# EAGLE design trig3_board_de0-nano - LTC6957 (EAGLE 9.6.2)
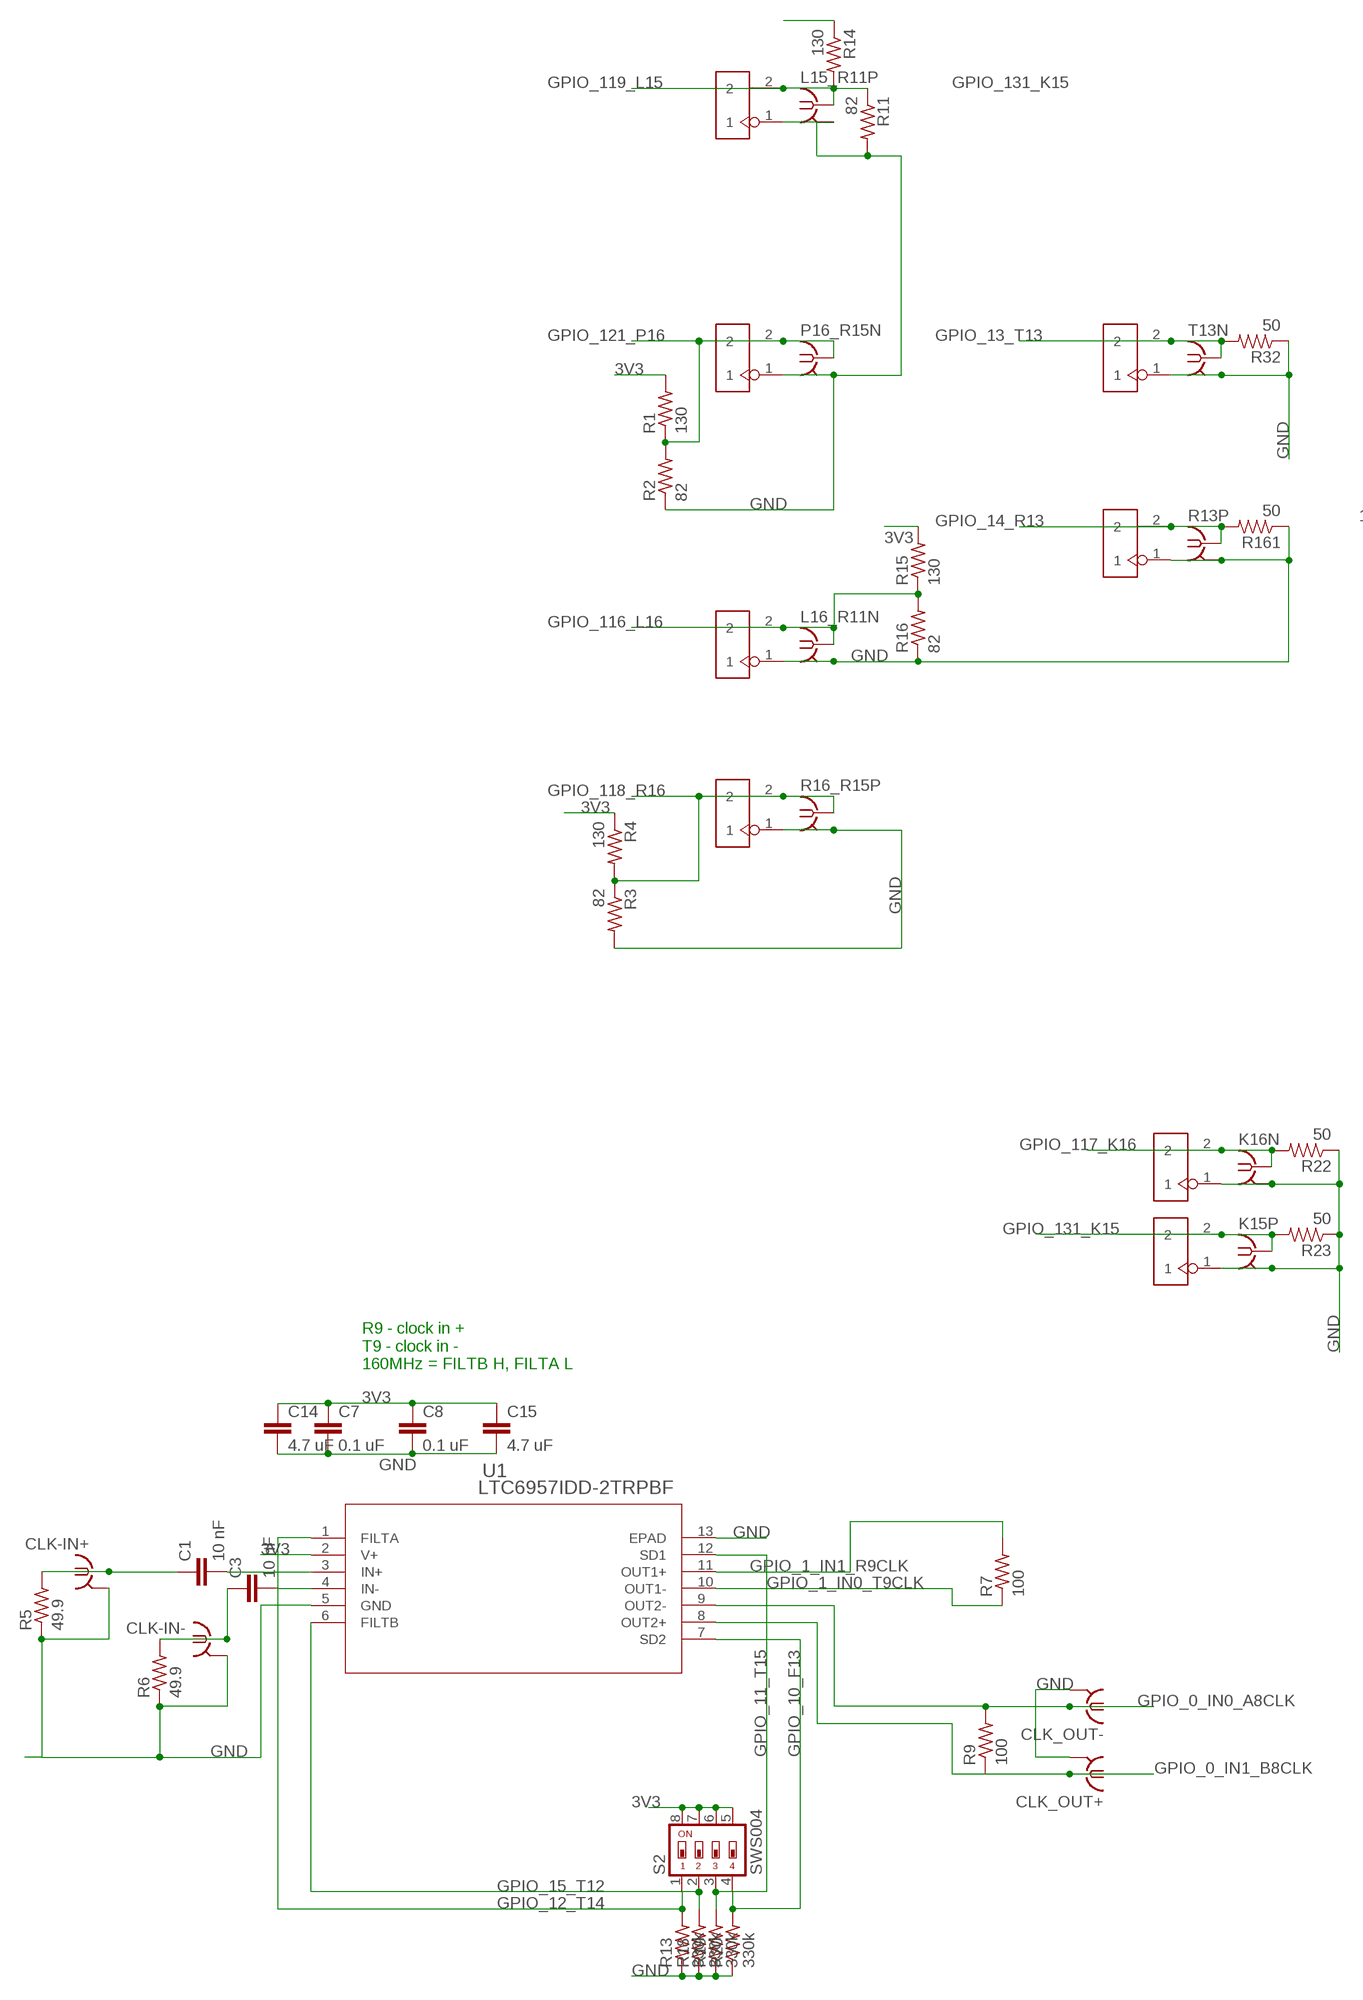
[diagram p0: schematic, sheet 1, part 1 of 2]
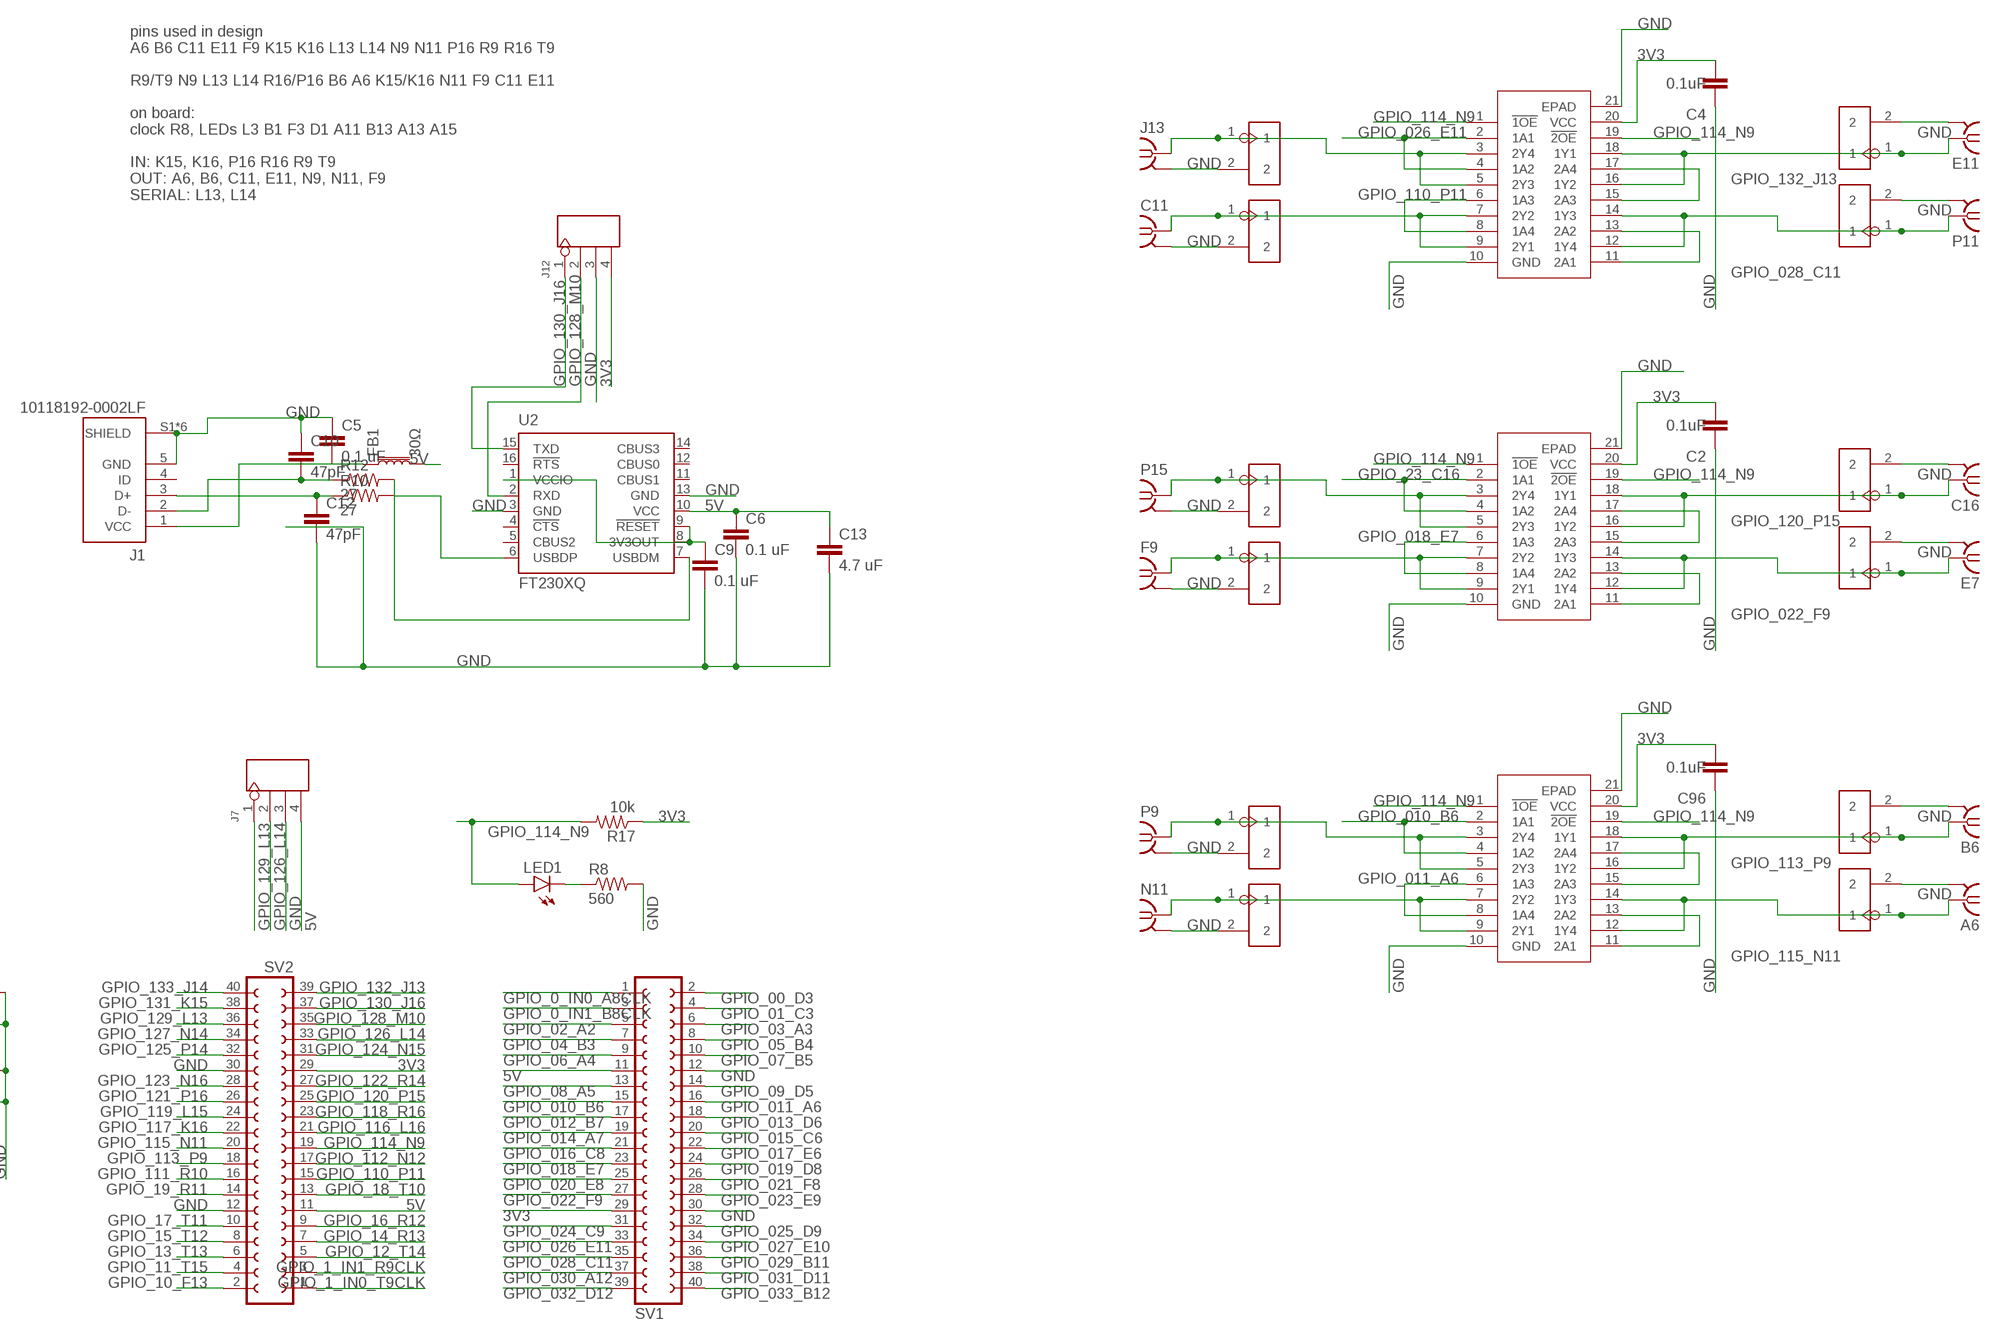
[diagram p1: schematic, sheet 1, part 2 of 2]

## Parts
A6  BU-SMB-V  [BU-SMB-V]
B6  BU-SMB-V  [BU-SMB-V]
C1  10 nF  C-EUC0603  [C0603]
C2  0.1uF  C-EUC0603  [C0603]
C3  10 nF  C-EUC0603  [C0603]
C4  0.1uF  C-EUC0603  [C0603]
C5  0.1 uF  C-EUC0603  [C0603]
C6  0.1 uF  C-EUC0603  [C0603]
C7  0.1 uF  C-EUC0603  [C0603]
C8  0.1 uF  C-EUC0603  [C0603]
C9  0.1 uF  C-EUC0603  [C0603]
C10  47pF  C-EUC0603  [C0603]
C11  BU-SMB-V  [BU-SMB-V]
C12  47pF  C-EUC0603  [C0603]
C13  4.7 uF  C-EUC0603  [C0603]
C14  4.7 uF  C-EUC0603  [C0603]
C15  4.7 uF  C-EUC0603  [C0603]
C16  BU-SMB-V  [BU-SMB-V]
C96  0.1uF  C-EUC0603  [C0603]
CLK-IN+  BU-SMB-V  [BU-SMB-V]
CLK-IN-  BU-SMB-V  [BU-SMB-V]
CLK_OUT+  BU-SMB-V  [BU-SMB-V]
CLK_OUT-  BU-SMB-V  [BU-SMB-V]
E7  BU-SMB-V  [BU-SMB-V]
E11  BU-SMB-V  [BU-SMB-V]
F9  BU-SMB-V  [BU-SMB-V]
FB1  30Ω  FERRITE_BEAD-0603-30OHM-100MHZ  [0603]
J1  10118192-0002LF  [AMPHENOL_10118192-0002LF]
J7  4p-2.54  DIP-BLACK-FEMALE-HEADER-VERT(4P-2.54)  [H4-2.54]
J12  4p-2.54  DIP-BLACK-FEMALE-HEADER-VERT(4P-2.54)  [H4-2.54]
J13  BU-SMB-V  [BU-SMB-V]
J17  2p-2.54  DIP-BLACK-MALE-HEADER-VERT(2P-2.54)  [H2-2.54]
J23  2p-2.54  DIP-BLACK-MALE-HEADER-VERT(2P-2.54)  [H2-2.54]
J24  2p-2.54  DIP-BLACK-MALE-HEADER-VERT(2P-2.54)  [H2-2.54]
J32  2p-2.54  DIP-BLACK-MALE-HEADER-VERT(2P-2.54)  [H2-2.54]
J34  2p-2.54  DIP-BLACK-MALE-HEADER-VERT(2P-2.54)  [H2-2.54]
J38  2p-2.54  DIP-BLACK-MALE-HEADER-VERT(2P-2.54)  [H2-2.54]
J42  2p-2.54  DIP-BLACK-MALE-HEADER-VERT(2P-2.54)  [H2-2.54]
J43  2p-2.54  DIP-BLACK-MALE-HEADER-VERT(2P-2.54)  [H2-2.54]
K15P  BU-SMB-V  [BU-SMB-V]
K16N  BU-SMB-V  [BU-SMB-V]
L15_R11P  BU-SMB-V  [BU-SMB-V]
L16_R11N  BU-SMB-V  [BU-SMB-V]
LED1  red  LEDSML0805  [SML0805]
N11  BU-SMB-V  [BU-SMB-V]
OJ41  2p-2.54  DIP-BLACK-MALE-HEADER-VERT(2P-2.54)  [H2-2.54]
OJ42  2p-2.54  DIP-BLACK-MALE-HEADER-VERT(2P-2.54)  [H2-2.54]
OJ43  2p-2.54  DIP-BLACK-MALE-HEADER-VERT(2P-2.54)  [H2-2.54]
OJ44  2p-2.54  DIP-BLACK-MALE-HEADER-VERT(2P-2.54)  [H2-2.54]
OJ57  2p-2.54  DIP-BLACK-MALE-HEADER-VERT(2P-2.54)  [H2-2.54]
OJ58  2p-2.54  DIP-BLACK-MALE-HEADER-VERT(2P-2.54)  [H2-2.54]
OJ59  2p-2.54  DIP-BLACK-MALE-HEADER-VERT(2P-2.54)  [H2-2.54]
OJ60  2p-2.54  DIP-BLACK-MALE-HEADER-VERT(2P-2.54)  [H2-2.54]
OJ73  2p-2.54  DIP-BLACK-MALE-HEADER-VERT(2P-2.54)  [H2-2.54]
OJ74  2p-2.54  DIP-BLACK-MALE-HEADER-VERT(2P-2.54)  [H2-2.54]
OJ75  2p-2.54  DIP-BLACK-MALE-HEADER-VERT(2P-2.54)  [H2-2.54]
OJ76  2p-2.54  DIP-BLACK-MALE-HEADER-VERT(2P-2.54)  [H2-2.54]
P9  BU-SMB-V  [BU-SMB-V]
P11  BU-SMB-V  [BU-SMB-V]
P15  BU-SMB-V  [BU-SMB-V]
P16_R15N  BU-SMB-V  [BU-SMB-V]
R1  130  R-US_R0603  [R0603]
R2  82  R-US_R0603  [R0603]
R3  82  R-US_R0603  [R0603]
R4  130  R-US_R0603  [R0603]
R5  49.9  R-US_R0603  [R0603]
R6  49.9  R-US_R0603  [R0603]
R7  100  R-US_R0603  [R0603]
R8  560  R-US_R0805  [R0805]
R9  100  R-US_R0603  [R0603]
R10  27  R-US_R0603  [R0603]
R11  82  R-US_R0603  [R0603]
R12  27  R-US_R0603  [R0603]
R13  330k  R-US_R0603  [R0603]
R13P  BU-SMB-V  [BU-SMB-V]
R14  130  R-US_R0603  [R0603]
R15  130  R-US_R0603  [R0603]
R16  82  R-US_R0603  [R0603]
R16_R15P  BU-SMB-V  [BU-SMB-V]
R17  10k  RESISTORAXIAL-0.3  [AXIAL-0.3]
R18  330k  R-US_R0603  [R0603]
R19  330k  R-US_R0603  [R0603]
R20  330k  R-US_R0603  [R0603]
R22  50  RESISTORAXIAL-0.3  [AXIAL-0.3]
R23  50  RESISTORAXIAL-0.3  [AXIAL-0.3]
R32  50  RESISTORAXIAL-0.3  [AXIAL-0.3]
R161  50  RESISTORAXIAL-0.3  [AXIAL-0.3]
S2  SWS004  [SMS-004]
SV1  FE20-2  [FE20-2]
SV2  FE20-2  [FE20-2]
T13N  BU-SMB-V  [BU-SMB-V]
U1  LTC6957IDD-2TRPBF  [DFN-12_DD_LIT]
U2  FT230XQ  [QFN16]
U3  SN74LVTH244ARGYR  [RGY20_3P05X2P05]
U4  SN74LVTH244ARGYR  [RGY20_3P05X2P05]
U5  SN74LVTH244ARGYR  [RGY20_3P05X2P05]

## Nets
3V3 [power]: C2.2 C4.2 C7.1 C8.1 C14.1 C15.1 C96.2 J12.4 R1.2 R4.1 R14.1 R15.2 R17.P$1 S2.5 S2.6 S2.7 S2.8 SV1.29 SV2.29 U1.2(V+) U3.20(VCC) U4.20(VCC) U5.20(VCC)
5V [power]: C6.1 C13.1 FB1.2 J7.4 SV1.11 SV2.11 U2.10(VCC)
GND: A6.2 A6.3 A6.4 A6.5 B6.2 B6.3 B6.4 B6.5 C2.1 C4.1 C5.1 C6.2 C7.2 C8.2 C9.2 C10.1 C11.2 C11.3 C11.4 C11.5 C12.2 C13.2 C14.2 C15.2 C16.2 C16.3 C16.4 C16.5 C96.1 CLK-IN+.2 CLK-IN+.3 CLK-IN+.4 CLK-IN+.5 CLK-IN-.2 CLK-IN-.3 CLK-IN-.4 CLK-IN-.5 CLK_OUT+.2 CLK_OUT+.3 CLK_OUT+.4 CLK_OUT+.5 CLK_OUT-.2 CLK_OUT-.3 CLK_OUT-.4 CLK_OUT-.5 E7.2 E7.3 E7.4 E7.5 E11.2 E11.3 E11.4 E11.5 F9.2 F9.3 F9.4 F9.5 J1.5(GND) J1.S1(SHIELD) J1.S2(SHIELD) J1.S3(SHIELD) J1.S4(SHIELD) J1.S5(SHIELD) J1.S6(SHIELD) J7.3 J12.3 J13.2 J13.3 J13.4 J13.5 J17.1 J23.1 J24.1 J32.1 J34.1 J38.1 J42.1 J43.1 K15P.2 K15P.3 K15P.4 K15P.5 K16N.2 K16N.3 K16N.4 K16N.5 L15_R11P.2 L15_R11P.3 L15_R11P.4 L15_R11P.5 L16_R11N.2 L16_R11N.3 L16_R11N.4 L16_R11N.5 N11.2 N11.3 N11.4 N11.5 OJ41.2 OJ42.2 OJ43.2 OJ44.2 OJ57.2 OJ58.2 OJ59.2 OJ60.2 OJ73.2 OJ74.2 OJ75.2 OJ76.2 P9.2 P9.3 P9.4 P9.5 P11.2 P11.3 P11.4 P11.5 P15.2 P15.3 P15.4 P15.5 P16_R15N.2 P16_R15N.3 P16_R15N.4 P16_R15N.5 R2.1 R3.2 R5.1 R6.1 R8.2 R11.2 R13.1 R13P.2 R13P.3 R13P.4 R13P.5 R16.1 R16_R15P.2 R16_R15P.3 R16_R15P.4 R16_R15P.5 R18.1 R19.1 R20.1 R22.P$1 R23.P$1 R32.P$1 R161.P$1 SV1.12 SV1.30 SV2.12 SV2.30 T13N.2 T13N.3 T13N.4 T13N.5 U1.5(GND) U1.13(EPAD) U2.3(GND) U2.13(GND) U3.10(GND) U3.21(EPAD) U4.10(GND) U4.21(EPAD) U5.10(GND) U5.21(EPAD)
GPIO_00_D3: SV1.2
GPIO_0_IN0_A8CLK: CLK_OUT-.1 R9.2 SV1.1 U1.9(OUT2-)
GPIO_0_IN1_B8CLK: CLK_OUT+.1 R9.1 SV1.3 U1.8(OUT2+)
GPIO_01_C3: SV1.4
GPIO_1_IN0_T9CLK: R7.1 SV2.1 U1.10(OUT1-)
GPIO_1_IN1_R9CLK: R7.2 SV2.3 U1.11(OUT1+)
GPIO_02_A2: SV1.5
GPIO_03_A3: SV1.6
GPIO_04_B3: SV1.7
GPIO_05_B4: SV1.8
GPIO_06_A4: SV1.9
GPIO_07_B5: SV1.10
GPIO_08_A5: SV1.13
GPIO_09_D5: SV1.14
GPIO_010_B6: SV1.15 U5.2(1A1) U5.4(1A2)
GPIO_10_F13: R20.2 S2.4 SV2.2 U1.7(SD2)
GPIO_011_A6: SV1.16 U5.6(1A3) U5.8(1A4)
GPIO_11_T15: R19.2 S2.3 SV2.4 U1.12(SD1)
GPIO_012_B7: SV1.17
GPIO_12_T14: R13.2 S2.1 SV2.5 U1.1(FILTA)
GPIO_013_D6: SV1.18
GPIO_13_T13: J38.2 R32.P$2 SV2.6 T13N.1
GPIO_014_A7: SV1.19
GPIO_14_R13: J17.2 R13P.1 R161.P$2 SV2.7
GPIO_015_C6: SV1.20
GPIO_15_T12: R18.2 S2.2 SV2.8 U1.6(FILTB)
GPIO_016_C8: SV1.21
GPIO_16_R12: SV2.9
GPIO_017_E6: SV1.22
GPIO_17_T11: SV2.10
GPIO_018_E7: SV1.23 U4.6(1A3) U4.8(1A4)
GPIO_18_T10: SV2.13
GPIO_019_D8: SV1.24
GPIO_19_R11: SV2.14
GPIO_020_E8: SV1.25
GPIO_021_F8: SV1.26
GPIO_022_F9: SV1.27 U4.11(2A1) U4.13(2A2)
GPIO_23_C16: U4.2(1A1) U4.4(1A2)
GPIO_023_E9: SV1.28
GPIO_024_C9: SV1.31
GPIO_025_D9: SV1.32
GPIO_026_E11: SV1.33 U3.2(1A1) U3.4(1A2)
GPIO_027_E10: SV1.34
GPIO_028_C11: SV1.35 U3.11(2A1) U3.13(2A2)
GPIO_029_B11: SV1.36
GPIO_030_A12: SV1.37
GPIO_031_D11: SV1.38
GPIO_032_D12: SV1.39
GPIO_033_B12: SV1.40
GPIO_110_P11: SV2.15 U3.6(1A3) U3.8(1A4)
GPIO_111_R10: SV2.16
GPIO_112_N12: SV2.17
GPIO_113_P9: SV2.18 U5.15(2A3) U5.17(2A4)
GPIO_114_N9: LED1.A R17.P$2 SV2.19 U3.1(!1OE) U3.19(!2OE) U4.1(!1OE) U4.19(!2OE) U5.1(!1OE) U5.19(!2OE)
GPIO_115_N11: SV2.20 U5.11(2A1) U5.13(2A2)
GPIO_116_L16: J32.2 L16_R11N.1 R15.1 R16.2 SV2.21
GPIO_117_K16: J23.2 K16N.1 R22.P$2 SV2.22
GPIO_118_R16: J34.2 R3.1 R4.2 R16_R15P.1 SV2.23
GPIO_119_L15: J43.2 L15_R11P.1 R11.1 R14.2 SV2.24
GPIO_120_P15: SV2.25 U4.15(2A3) U4.17(2A4)
GPIO_121_P16: J42.2 P16_R15N.1 R1.1 R2.2 SV2.26
GPIO_122_R14: SV2.27
GPIO_123_N16: SV2.28
GPIO_124_N15: SV2.31
GPIO_125_P14: SV2.32
GPIO_126_L14: J7.2 SV2.33
GPIO_127_N14: SV2.34
GPIO_128_M10: J12.2 SV2.35 U2.2(RXD)
GPIO_129_L13: J7.1 SV2.36
GPIO_130_J16: J12.1 SV2.37 U2.15(TXD)
GPIO_131_K15: J24.2 K15P.1 R23.P$2 SV2.38
GPIO_132_J13: SV2.39 U3.15(2A3) U3.17(2A4)
GPIO_133_J14: SV2.40
N$2: C1.1 CLK-IN+.1 R5.2
N$3: C3.1 CLK-IN-.1 R6.2
N$4: C1.2 U1.3(IN+)
N$5: C3.2 U1.4(IN-)
N$6: C5.2 FB1.1 J1.1(VCC)
N$7: C12.1 J1.3(D+) R10.1
N$9: LED1.C R8.1
N$11: C10.2 J1.2(D-) R12.1
N$12: R10.2 U2.6(USBDP)
N$13: R12.2 U2.7(USBDM)
N$14: C9.1 U2.1(VCCIO) U2.8(3V3OUT) U2.9(!RESET)
OUT21: B6.1 OJ44.1 U5.16(1Y2) U5.18(1Y1)
OUT22: A6.1 OJ43.1 U5.12(1Y4) U5.14(1Y3)
OUT23: OJ41.1 P9.1 U5.3(2Y4) U5.5(2Y3)
OUT24: N11.1 OJ42.1 U5.7(2Y2) U5.9(2Y1)
OUT29: C16.1 OJ60.1 U4.16(1Y2) U4.18(1Y1)
OUT30: E7.1 OJ59.1 U4.12(1Y4) U4.14(1Y3)
OUT31: OJ57.1 P15.1 U4.3(2Y4) U4.5(2Y3)
OUT32: F9.1 OJ58.1 U4.7(2Y2) U4.9(2Y1)
OUT37: E11.1 OJ76.1 U3.16(1Y2) U3.18(1Y1)
OUT38: OJ75.1 P11.1 U3.12(1Y4) U3.14(1Y3)
OUT39: J13.1 OJ73.1 U3.3(2Y4) U3.5(2Y3)
OUT40: C11.1 OJ74.1 U3.7(2Y2) U3.9(2Y1)
Unconnected: J1.4(ID) U2.4(!CTS) U2.5(CBUS2) U2.11(CBUS1) U2.12(CBUS0) U2.14(CBUS3) U2.16(!RTS)

## Notes on the sheet
- pins used in design
  A6 B6 C11 E11 F9 K15 K16 L13 L14 N9 N11 P16 R9 R16 T9
  
  R9/T9 N9 L13 L14 R16/P16 B6 A6 K15/K16 N11 F9 C11 E11 
  
  on board:
  clock R8, LEDs L3 B1 F3 D1 A11 B13 A13 A15 
  
  IN: K15, K16, P16 R16 R9 T9
  OUT: A6, B6, C11, E11, N9, N11, F9
  SERIAL: L13, L14
- R9 - clock in +
  T9 - clock in -
  160MHz = FILTB H, FILTA L

## Library data of the parts
A6 B6 C11 C16 CLK-IN+ CLK-IN- CLK_OUT+ CLK_OUT- E7 E11 F9 J13 K15P K16N L15_R11P L16_R11N N11 P9 P11 P15 P16_R15N R13P R16_R15P T13N = con-coax:BU-SMB-V: FEMALE SMB CONNECTOR Radiall distributor RS 112-2993; LCSC_PART#: C496549; OC_FARNELL: unknown; OC_NEWARK: unknown
C1 C3 = rcl:C-EU: CAPACITOR, European symbol; LCSC_PART#: C57112; SPICEPREFIX: C
C2 C4-C9 C96 = rcl:C-EU: CAPACITOR, European symbol; LCSC_PART#: C14663; SPICEPREFIX: C
C10 C12 = rcl:C-EU: CAPACITOR, European symbol; LCSC_PART#: C1671; SPICEPREFIX: C
C13-C15 = rcl:C-EU: CAPACITOR, European symbol; LCSC_PART#: C19666; SPICEPREFIX: C
FB1 = SparkFun-Coils:FERRITE_BEAD: Ferrite Bead (blocks, cores, rings, chokes, etc.) Inductor with layers of ferrite used to suppress high frequencies. Often used to isolate high frequency noise. SparkFun Products: IOIO-OTG - V2.2 <https://www.sparkfun.com/products/13613> SparkFun SAMD21 Mini Breakout <https://www.sparkfun.com/products/13664> SparkFun 6 Degrees of Freedom Breakout - LSM6DS3 <https://www.sparkfun.com/products/13339> SparkFun SAMD21 Dev Breakout <https://www.sparkfun.com/products/13672>; LCSC_PART#: C1002; PROD_ID: NDUC-07859
J1 = 10118192-0002LF:10118192-0002LF: USB - micro B USB 2.0 Receptacle Connector 5 Position Surface Mount, Right Angle; LCSC_PART#: C132564; MANUFACTURER: Amphenol; MAXIMUM_PACKAGE_HEIGHT: 2.8mm; PARTREV: B; STANDARD: Manufacturer Recommendations
J7 J12 = Seeed-Connector:DIP-BLACK-FEMALE-HEADER-VERT(4P-2.54): 320030017; MPN: F185-1104A1BSYA1
J17 J23 J24 J32 J34 J38 J42 J43 OJ41-OJ44 OJ57-OJ60 OJ73-OJ76 = Seeed-Connector:DIP-BLACK-MALE-HEADER-VERT(2P-2.54): 320020016; MPN: P125-1102A0BS116A1
LED1 = led:LED: LED OSRAM: - CHIPLED LG R971, LG N971, LY N971, LG Q971, LY Q971, LO R971, LY R971 LH N974, LH R974 LS Q976, LO Q976, LY Q976 LO Q996 - Hyper CHIPLED LW Q18S LB Q993, LB Q99A, LB R99A - SideLED LS A670, LO A670, LY A670, LG A670, LP A670 LB A673, LV A673, LT A673, LW A673 LH A674 LY A675 LS A676, LA A676, LO A676, LY A676, LW A676 LS A679, LY A679, LG A679 - Hyper Micro SIDELED® LS Y876, LA Y876, LO Y876, LY Y876 LT Y87S - SmartLED LW L88C, LW L88S LB L89C, LB L89S, LG L890 LS L89K, LO L89K, LY L89K LS L896, LA L896, LO L896, LY L896 - TOPLED LS T670, LO T670, LY T670, LG T670, LP T670 LSG T670, LSP T670, LSY T670, LOP T670, LYG T670 LG T671, LOG T671, LSG T671 LB T673, LV T673, LT T673, LW T673 LH T674 LS T676, LA T676, LO T676, LY T676, LB T676, LH T676, LSB T676, LW T676 LB T67C, LV T67C, LT T67C, LS T67K, LO T67K, LY T67K, LW E67C LS E67B, LA E67B, LO E67B, LY E67B, LB E67C, LV E67C, LT E67C LW T67C LS T679, LY T679, LG T679 LS T770, LO T770, LY T770, LG T770, LP T770 LB T773, LV T773, LT T773, LW T773 LH T774 LS E675, LA E675, LY E675, LS T675 LS T776, LA T776, LO T776, LY T776, LB T776 LHGB T686 LT T68C, LB T68C - Hyper Mini TOPLED® LB M676 - Mini TOPLED Santana® LG M470 LS M47K, LO M47K, LY M47K Source: http://www.osram.convergy.de LUXEON: - LUMILED® LXK2-PW12-R00, LXK2-PW12-S00, LXK2-PW14-U00, LXK2-PW14-V00 LXK2-PM12-R00, LXK2-PM12-S00, LXK2-PM14-U00 LXK2-PE12-Q00, LXK2-PE12-R00, LXK2-PE12-S00, LXK2-PE14-T00, LXK2-PE14-U00 LXK2-PB12-K00, LXK2-PB12-L00, LXK2-PB12-M00, LXK2-PB14-N00, LXK2-PB14-P00, LXK2-PB14-Q00 LXK2-PR12-L00, LXK2-PR12-M00, LXK2-PR14-Q00, LXK2-PR14-R00 LXK2-PD12-Q00, LXK2-PD12-R00, LXK2-PD12-S00 LXK2-PH12-R00, LXK2-PH12-S00 LXK2-PL12-P00, LXK2-PL12-Q00, LXK2-PL12-R00 Source: www.luxeon.com KINGBRIGHT: KA-3528ASYC Source: www.kingbright.com; LCSC_PART#: C84256
R1 R4 R14 R15 = rcl:R-US_: RESISTOR, American symbol; LCSC_PART#: C22796; SPICEPREFIX: R
R2 R3 R11 R16 = rcl:R-US_: RESISTOR, American symbol; LCSC_PART#: C23255; SPICEPREFIX: R
R5 R6 = rcl:R-US_: RESISTOR, American symbol; LCSC_PART#: C23185; SPICEPREFIX: R
R7 R9 = rcl:R-US_: RESISTOR, American symbol; LCSC_PART#: C22775; SPICEPREFIX: R
R8 = resistor:R-US_: RESISTOR, American symbol; LCSC_PART#: C28636
R10 R12 = rcl:R-US_: RESISTOR, American symbol; LCSC_PART#: C25190; SPICEPREFIX: R
R13 R18-R20 = rcl:R-US_: RESISTOR, American symbol; LCSC_PART#: C23137; SPICEPREFIX: R
R17 R22 R23 R32 R161 = SparkFun-Passives:RESISTOR: Resistor Basic schematic elements and footprints for 0603, 1206, and PTH resistors.
S2 = smd-special:SWS004: SMD Dip Switch 4 pol.; LCSC_PART#: C221954
SV1 SV2 = con-lsta:FE20-2: FEMALE HEADER; OC_FARNELL: unknown; OC_NEWARK: unknown
U1 = ltc6957-2:LTC6957IDD-2TRPBF; COPYRIGHT: Copyright (C) 2023 Ultra Librarian. All rights reserved.; LCSC_PART#: C689878; MANUFACTURER_PART_NUMBER: LTC6957IDD-2#TRPBF; MFR_NAME: Analog Devices Inc
U2 = ftdichip-rotate-footprint-jlcpcb:FT230X: USB to BASIC UART IC Auto generated by make-symbol-device-package-bsdl.ulp Rev. 43 Source: Data sheet <http://www.ftdichip.com/Support/Documents/DataSheets/ICs/DS_FT230X.pdf>; LCSC_PART#: C128629
U3-U5 = sn74lvth244argyr:SN74LVTH244ARGYR; COPYRIGHT: Copyright (C) 2023 Ultra Librarian. All rights reserved.; LCSC_PART#: C2869480; MANUFACTURER_PART_NUMBER: SN74LVTH244ARGYR; MFR_NAME: Texas Instruments

## Board
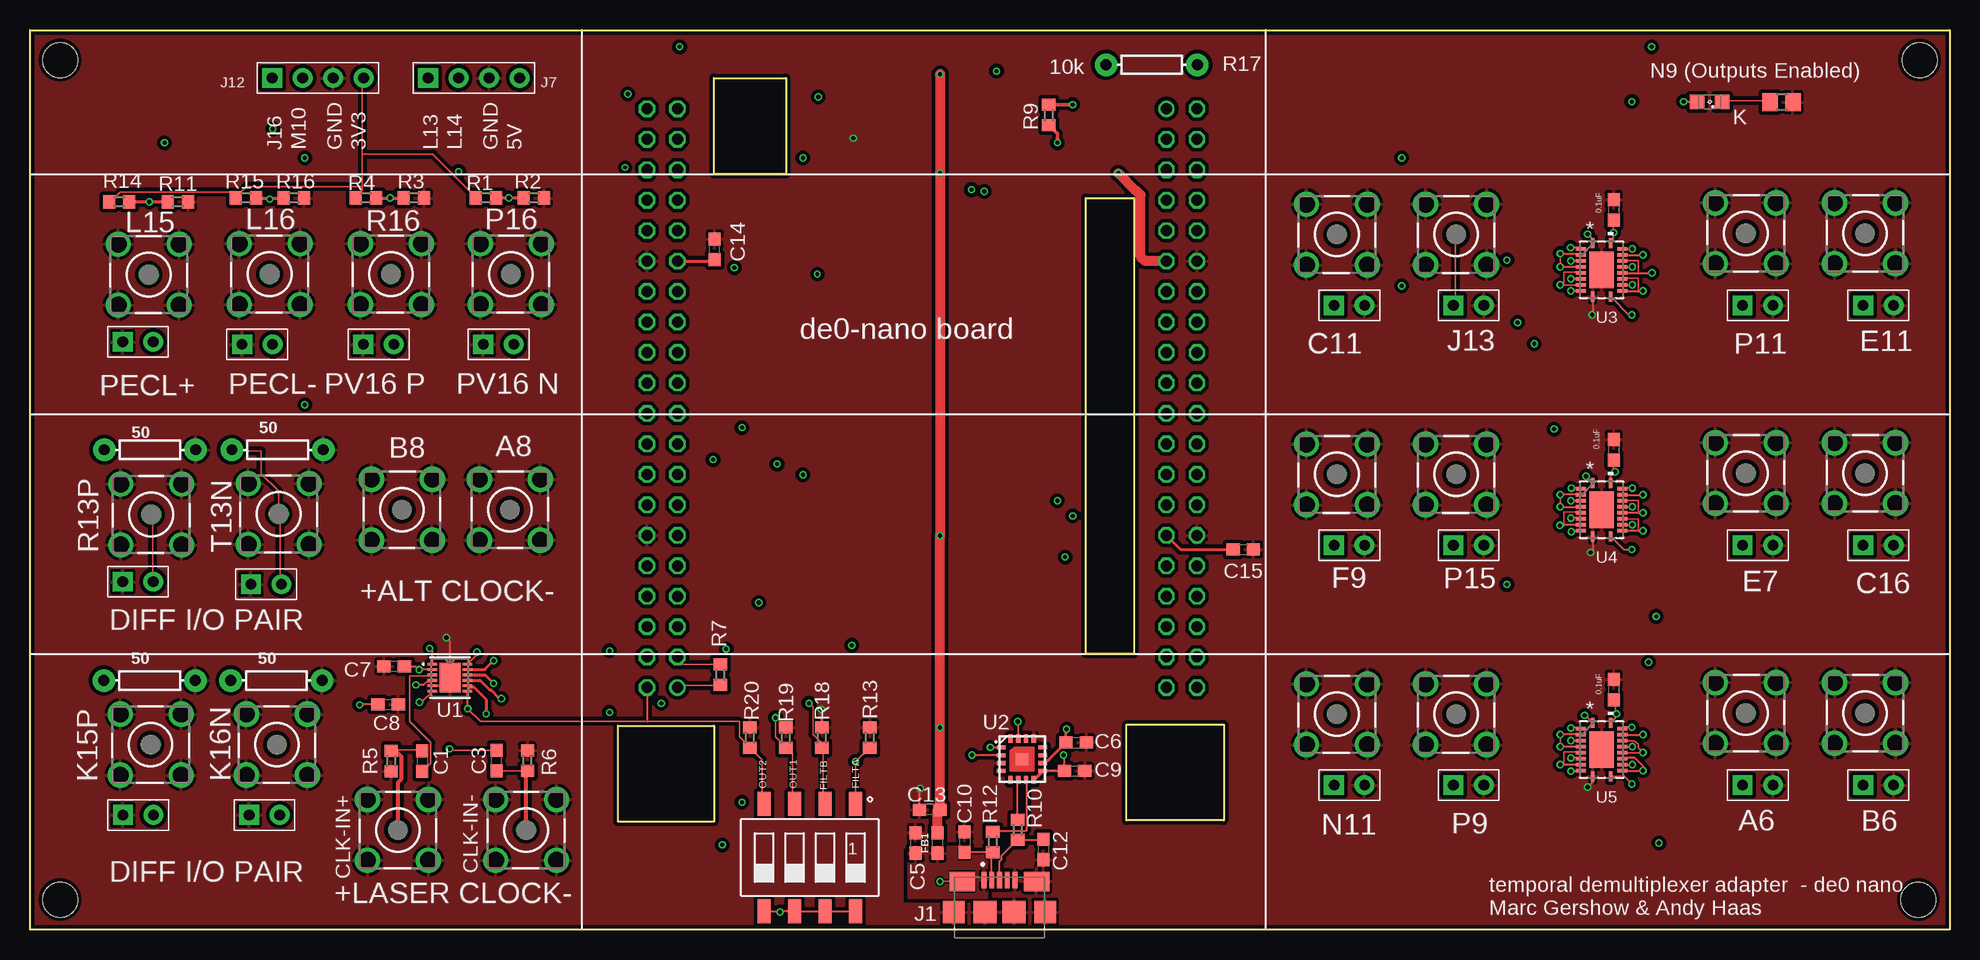
[diagram p2: board, top side]
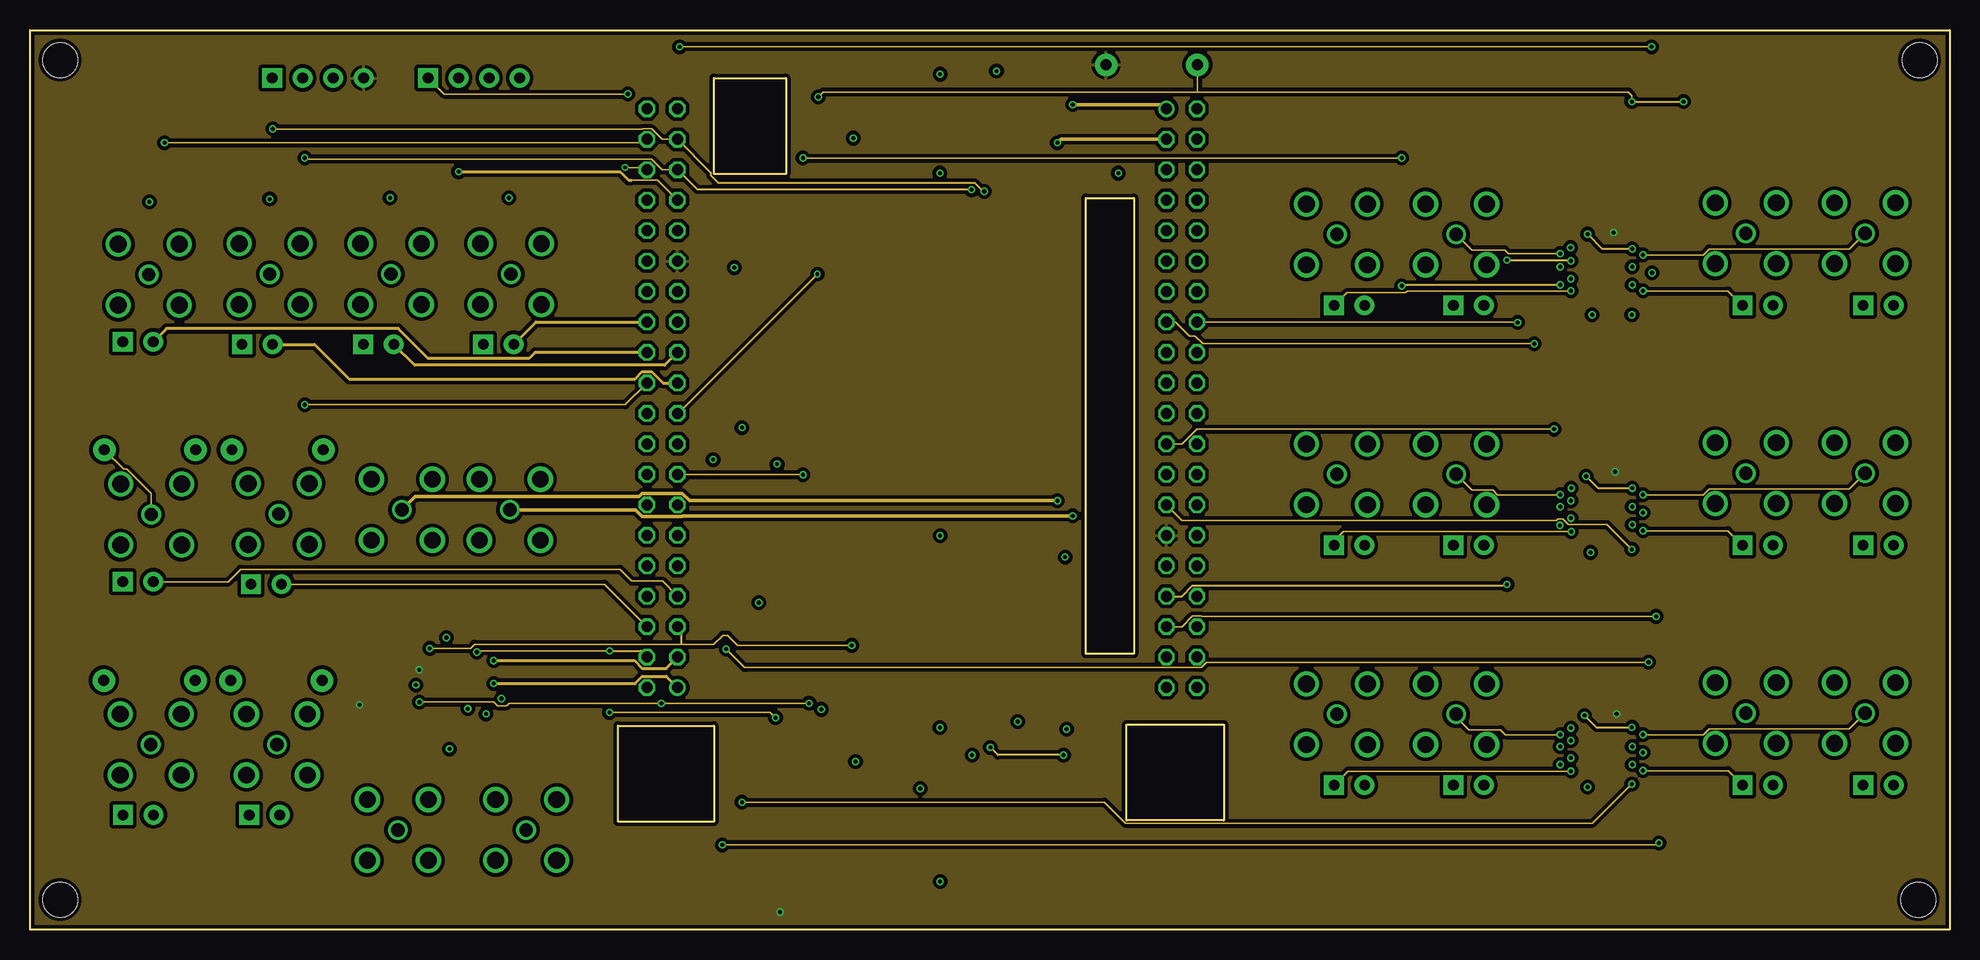
[diagram p3: board, inner layer Route2]
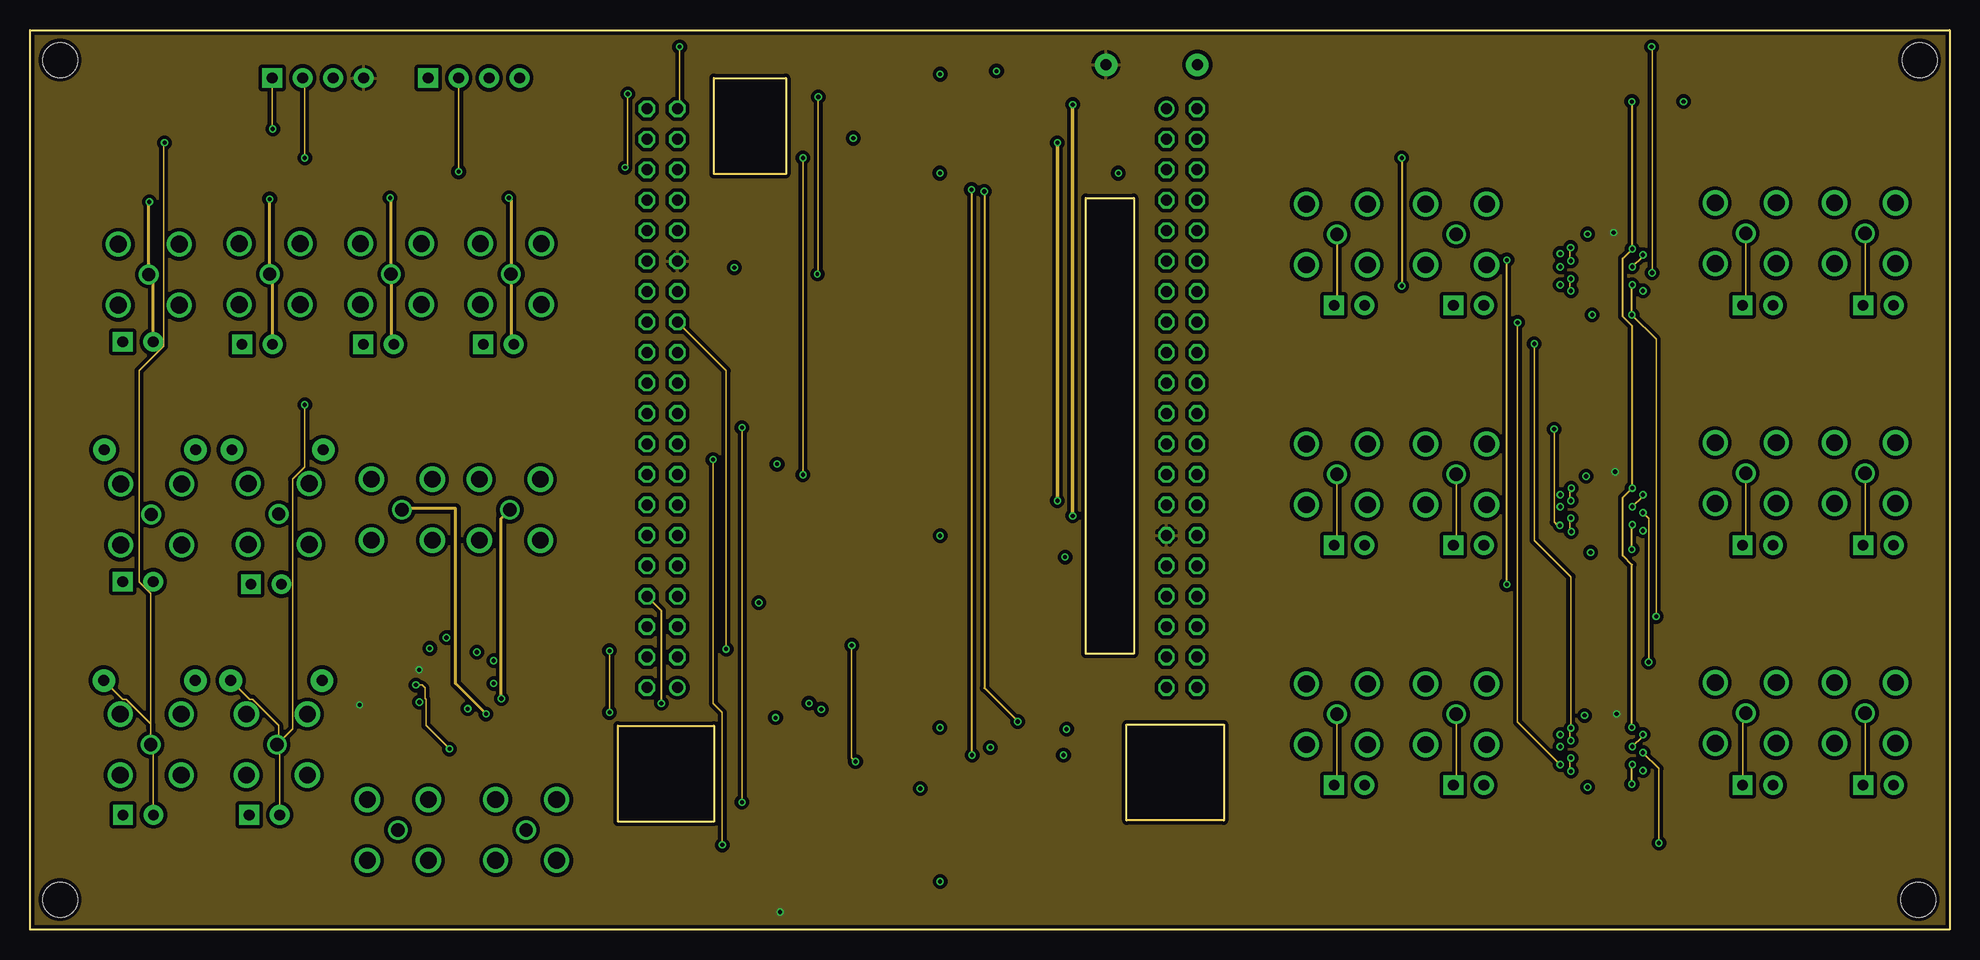
[diagram p4: board, inner layer Route15]
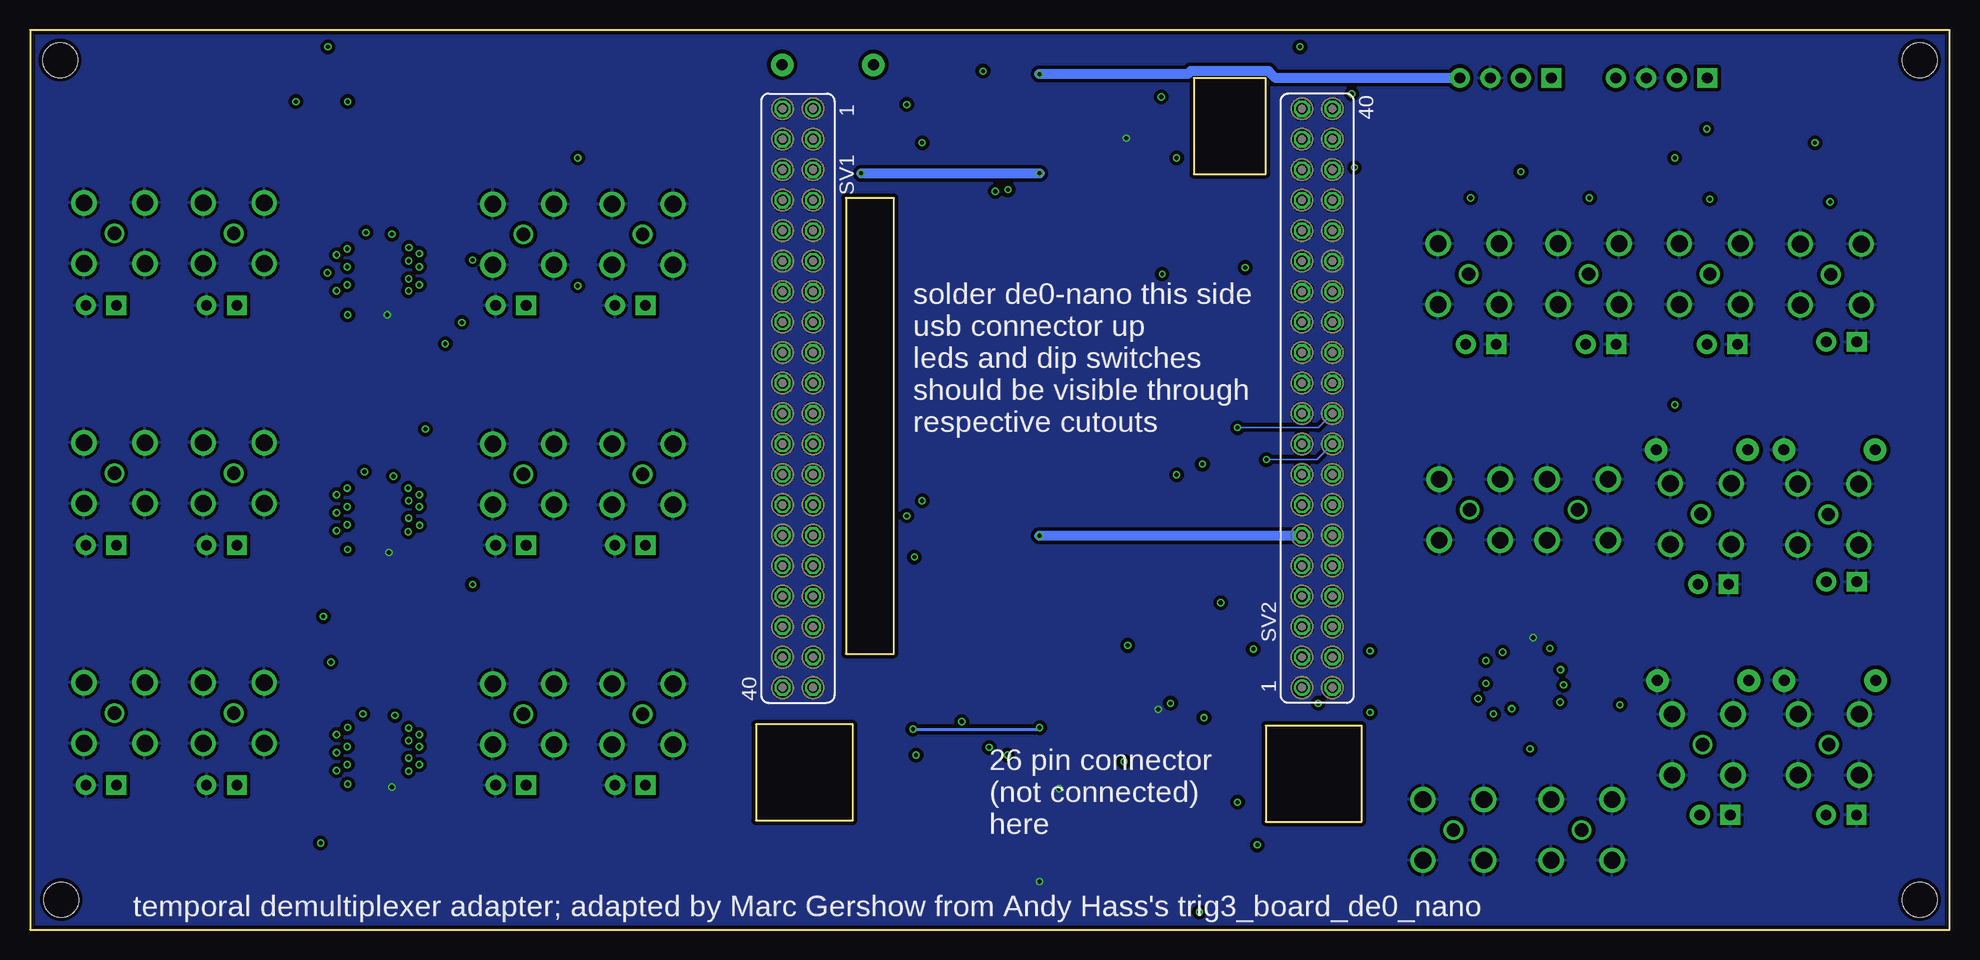
[diagram p5: board, bottom side, seen from below]

Size 160 x 75 mm. Coordinates in mm from the lower left corner, seen from the top.
Outline: 99.5,17.1 99.5,9.1 91.4,9.1 91.4,17.1 99.5,17.1
Outline: 57,17 57,9 49,9 49,17 57,17
Outline: 92,61 92,23 88,23 88,61 92,61
Outline: 57,63 57,71 63,71 63,63 57,63
Outline: 0,0 0,75 160,75 160,0 0,0
Copper layers (1*2*15*16): Top 0.035559375mm / dielectric 0.17018125mm / Route2 0.01778125mm / dielectric 47mil / Route15 0.01778125mm / dielectric 0.17018125mm / Bottom 0.035559375mm
Design rules "jlcpcb-4-layer *": minimum track width 5mil, minimum drill 0.3mm, track to track 0.126490625mm, track to pad 0.126490625mm, pad to pad 0.126490625mm, via to via 0.126490625mm, smd to smd 0mil, copper to edge 0.1mm, drill to drill 5mil, minimum pad ring 4mil, minimum via ring 5mil, stop-mask expansion 3mil, vias tented up to drill 100mil, thermal gap 10mil
Holes 2.9 mm at 2.5,2.5 157.4,2.5 2.5,72.5 157.5,72.5

### Footprints (pad centres in the part's own frame; a part is rotated, then mirrored left to right if it is on the bottom)
BU-SMB-V = drill 1.1: 1 0,0 | drill 1.4: 2 -2.54,2.54; 3 2.54,2.54; 4 2.54,-2.54; 5 -2.54,-2.54
C0603 = smd 1.1 x 1: 1 -0.85,0; 2 0.85,0
0603 = smd 1.1 x 1: 1 -0.85,0; 2 0.85,0
AMPHENOL_10118192-0002LF = smd 0.4 x 1.35: 1 -1.3,0; 2 -0.65,0; 3 0,0; 4 0.65,0; 5 1.3,0 | smd 2.1 x 1.6: S1 -3.1,-0.125; S2 3.1,-0.125 | smd 1.8 x 1.9: S3 -3.8,-2.675; S6 3.8,-2.675 | smd 1.9 x 1.9: S4 -1.2,-2.675; S5 1.2,-2.675
H4-2.54 = drill 0.889 pad 1.651 square: 1 0,3.81 | drill 0.889 pad 1.651: 2 0,1.27; 3 0,-1.27; 4 0,-3.81
H2-2.54 = drill 0.889 pad 1.651 square: 1 0,1.27 | drill 0.889 pad 1.651: 2 0,-1.27
SML0805 = smd 1.2 x 1.2: A 1.05,0; C -1.05,0
R0603 = smd 1 x 1.1: 1 -0.85,0; 2 0.85,0
R0805 = smd 1.3 x 1.5: 1 -0.95,0; 2 0.95,0
AXIAL-0.3 = drill 0.9 pad 1.88: P$1 -3.81,0; P$2 3.81,0
SMS-004 = smd 1.092 x 2.007: 1 -3.81,-4.496; 2 -1.27,-4.496; 3 1.27,-4.496; 4 3.81,-4.496; 5 3.81,4.496; 6 1.27,4.496; 7 -1.27,4.496; 8 -3.81,4.496
FE20-2 = drill 0.914: 1 -24.13,1.27 | drill 0.914 octagon: 2 -24.13,-1.27; 3 -21.59,1.27; 4 -21.59,-1.27; 5 -19.05,1.27; 6 -19.05,-1.27; 7 -16.51,1.27; 8 -16.51,-1.27; 9 -13.97,1.27; 10 -13.97,-1.27; 11 -11.43,1.27; 12 -11.43,-1.27; 13 -8.89,1.27; 14 -8.89,-1.27; 15 -6.35,1.27; 16 -6.35,-1.27; 17 -3.81,1.27; 18 -3.81,-1.27; 19 -1.27,1.27; 20 -1.27,-1.27; 21 1.27,1.27; 22 1.27,-1.27; 23 3.81,1.27; 24 3.81,-1.27; 25 6.35,1.27; 26 6.35,-1.27; 27 8.89,1.27; 28 8.89,-1.27; 29 11.43,1.27; 30 11.43,-1.27; 31 13.97,1.27; 32 13.97,-1.27; 33 16.51,1.27; 34 16.51,-1.27; 35 19.05,1.27; 36 19.05,-1.27; 37 21.59,1.27; 38 21.59,-1.27; 39 24.13,1.27; 40 24.13,-1.27
DFN-12_DD_LIT = smd 0.229 x 0.805: 1 -1.125,-1.452; 2 -0.675,-1.452; 3 -0.225,-1.452; 4 0.225,-1.452; 5 0.675,-1.452; 6 1.125,-1.452; 7 1.125,1.452; 8 0.675,1.452; 9 0.225,1.452; 10 -0.225,1.452; 11 -0.675,1.452; 12 -1.125,1.452 | smd 2.48 x 1.75: 13 0,0
QFN16 = smd 0.35 x 0.7: 1 -0.975,-1.725; 2 -0.325,-1.725; 3 0.325,-1.725; 4 0.975,-1.725; 9 0.975,1.725; 10 0.325,1.725; 11 -0.325,1.725; 12 -0.975,1.725 | smd 0.7 x 0.35: 5 1.725,-0.975; 6 1.725,-0.325; 7 1.725,0.325; 8 1.725,0.975; 13 -1.725,0.975; 14 -1.725,0.325; 15 -1.725,-0.325; 16 -1.725,-0.975 | smd 1 x 1: TAB 0,0
RGY20_3P05X2P05 = smd 0.85 x 0.28: 1 -2.225,-0.75; 10 2.225,-0.75; 11 2.225,0.75; 20 -2.225,0.75 | smd 0.28 x 0.85: 2 -1.75,-1.725; 3 -1.25,-1.725; 4 -0.75,-1.725; 5 -0.25,-1.725; 6 0.25,-1.725; 7 0.75,-1.725; 8 1.25,-1.725; 9 1.75,-1.725; 12 1.75,1.725; 13 1.25,1.725; 14 0.75,1.725; 15 0.25,1.725; 16 -0.25,1.725; 17 -0.75,1.725; 18 -1.25,1.725; 19 -1.75,1.725 | smd 3.05 x 2.05: 21 0,0

### Placement (x,y rotation side)
A6  143.02,18.05 0 top
B6  152.96,18.05 0 top
C1  32.7,14.05 270 top
C2  132,40 270 top
C3  38.91,14.09 90 top
C4  132,60 270 top
C5  73.83,7.22 270 top
C6  87.2,15.58 0 top
C7  30.36,21.95 180 top
C8  29.85,18.77 0 top
C9  87.07,13.22 0 top
C10  77.91,7.3 270 top
C11  108.93,57.95 180 top
C12  84.46,6.68 270 top
C13  75,10 180 top
C14  57.06,56.71 90 top
C15  101.13,31.69 0 top
C16  152.96,38.05 0 top
C96  132,20 270 top
CLK-IN+  30.67,8.3 180 top
CLK-IN-  41.36,8.3 180 top
CLK_OUT+  31,35 0 top
CLK_OUT-  40,35 0 top
E7  143.02,38.05 0 top
E11  152.96,58.05 0 top
F9  108.93,37.95 180 top
FB1  75.67,7.22 90 top
J1  80.81,4.13 0 top
J7  37,71 90 top
J12  24,71 90 top
J13  118.88,57.95 180 top
J17  9,29 90 top
J23  19.54,9.55 90 top
J24  9.02,9.55 90 top
J32  18.95,48.79 90 top
J34  29.05,48.79 90 top
J38  19.69,28.79 90 top
J42  39.05,48.79 90 top
J43  9,49 90 top
K15P  10.06,15.41 180 top
K16N  20.58,15.41 180 top
L15_R11P  9.9,54.6 180 top
L16_R11N  19.98,54.65 180 top
LED1  140,69 180 top
N11  108.93,17.95 180 top
OJ41  119.92,12.04 90 top
OJ42  109.97,12.04 90 top
OJ43  144.02,12.04 90 top
OJ44  154.07,12.04 90 top
OJ57  119.92,32.04 90 top
OJ58  109.97,32.04 90 top
OJ59  144.02,32.04 90 top
OJ60  154.07,32.04 90 top
OJ73  119.92,52.04 90 top
OJ74  109.97,52.04 90 top
OJ75  144.02,52.04 90 top
OJ76  154.07,52.04 90 top
P9  118.88,17.95 180 top
P11  143.02,58.05 0 top
P15  118.88,37.95 180 top
P16_R15N  40.09,54.65 180 top
R1  38,61 180 top
R2  42,61 180 top
R3  32,61 0 top
R4  28,61 0 top
R5  30.12,14.04 90 top
R6  41.47,14.09 270 top
R7  57.54,21.24 90 top
R8  146,69 0 top
R9  84.92,67.91 90 top
R10  82.33,8.31 90 top
R11  12.33,60.67 0 top
R12  80.25,7.3 90 top
R13  70,16 270 top
R13P  10.1,34.6 180 top
R14  7.44,60.67 0 top
R15  18,61 180 top
R16  22,61 180 top
R16_R15P  30.09,54.65 180 top
R17  93.5,72.1 0 top
R18  66,16 270 top
R19  63,16 270 top
R20  60,16 270 top
R22  20.54,20.76 180 top
R23  9.97,20.76 180 top
R32  20.64,40 180 top
R161  10,40 180 top
S2  65,6 180 top
SV1  96,44.3 270 bottom
SV2  52.7,44.3 90 bottom
T13N  20.72,34.65 180 top
U1  35,21 270 top
U2  82.69,14.2 270 top
U3  131,55 270 top
U4  131,35 270 top
U5  131,15 270 top

### Tracks (layer width: path | path; a pad name or v marks a point on that pad's centre or on a via)
3V3  (via drill 0.35)
  Top 0.127: R14.1 6.74,60.68 7.53,61.47 17.06,61.47 17.06,61.16 R15.2 17.22,61.16 18.01,61.95 27.7,61.95 | 132.15,17.98 132.15,17.66 131.84,17.34 U5.20 | 132.15,17.98 132.15,19.09 C96.2 | 132.15,17.98 v132.25,17.98 | 27.7,64.65 27.7,71 J12.4 | 27.7,64.65 27.7,61.95 | 27.7,61.95 27.7,61.63 27.22,61.16 R4.1 | 27.7,64.65 33.57,64.65 37.06,61.16 R1.2 | C2.2 132,39.09 132,38.3 v132.12,38.17 | v132,58.11 132,59.09 C4.2 | S2.7 66.27,1.47 S2.7
  Top 0.152: U4.20 131.75,37.8 v132.12,38.17 | U3.20 132,57.47 v132,58.11 | U1.2 32.44,21.67 v32.43,21.66 32.14,21.95 C7.1 | C8.1 27.5,18.77 v27.47,18.74 | S2.5 62.49,1.5 | 62.49,1.5 v62.53,1.47 | 62.49,1.5 S2.6 S2.7 S2.8
  Top 0.254: SV1.29 95.91,31.69 C15.1 | SV2.29 56.94,55.73 C14.1
  pour Route2 (isolate 0.305): -2.04,77.03 161.84,77.03 161.84,-1.08 -2.04,-1.08
  pour Route15 (isolate 0.305): -2.62,77.67 162.47,77.67 162.47,-1.71 -2.62,-1.71
5V  (via drill 0.35)
  Top 0.254: U2.10 84.64,14.1 84.87,14.1 85.02,14.25 C6.1 86.35,16.65 v86.4,16.7
  Top 0.813: C13.1 v75.85,16.83 v75.85,32.82 | v75.85,32.82 v75.86,32.83 | v75.86,71.31 v75.85,71.3 v75.85,63.06 v75.85,32.82 | SV1.11 92.97,55.73 92.58,56.12 92.58,61.24 92.24,61.58 92.2,61.58 v90.72,63.06 | 76,9.85 C13.1 | FB1.2 75.67,10 C13.1
  Bottom 0.254: v86.4,16.7 75.98,16.7 v75.85,16.83
  Bottom 0.813: v75.86,32.83 54.01,32.83 SV2.11 | J7.4 56.18,71 56.76,71.58 63.24,71.58 63.51,71.31 v75.86,71.31 | v90.72,63.06 v75.85,63.06
GND  (via drill 0.35)
  Top 0.127: J1.S1 v75.86,4.01
  Top 0.152: U5.10 130.25,12.29 v129.84,11.88 | U4.10 130.25,31.6 v130.09,31.44 | U3.10 130.25,51.28 v130.22,51.25 | U1.5 34.33,20.33 U1.13 35,24.04 v34.71,24.33 | R18.1 66,18.31 v65.95,18.36 | C13.2 74.15,11.69 v74.21,11.75
  other vias: 68.62,65.98
  pour Bottom (isolate 0.305): 167,81 167,-10 -7,-10 -7,81
  pour Top (isolate 0.305, rank 2): -3.9,78.94 163.11,78.94 163.11,-3.62 -4.53,-3.62 -4.53,78.94
GND1  (via drill 0.35)
  other vias: 58.72,55.19
GND2  (via drill 0.35)
  other vias: 80.56,71.57
GND3  (via drill 0.35)
  other vias: 62.27,38.8
GND4  (via drill 0.35)
  other vias: 60.75,27.25
GND6  (via drill 0.35)
  other vias: 86.28,31.06
GPIO_0_IN0_A8CLK  (via drill 0.35)
  Top 0.254: v39.28,19.24 39.16,19.24 38.42,19.98 38.3,19.98 37.51,20.77 U1.9
  Top 0.279: R9.2 84.94,68.78 v86.91,68.78
  Route2 0.279: CLK_OUT-.1 50.49,35 51.04,34.46 54.36,34.46 54.39,34.48 v86.91,34.48 | v86.91,68.78 94.38,68.78 SV1.1
  Route15 0.254: v39.28,19.24 39.28,34.28 CLK_OUT-.1
  Route15 0.279: v86.91,34.48 v86.91,68.78
GPIO_0_IN1_B8CLK  (via drill 0.35)
  Top 0.254: U1.8 36.53,20.24 36.96,20.24 38.02,19.19 v38.02,17.98
  Top 0.279: R9.1 85.64,66.33 v85.64,65.6
  Route2 0.279: SV1.3 85.93,65.89 v85.64,65.6 | v85.64,35.75 54.97,35.75 54.36,36.36 51.04,36.36 50.77,36.09 32.09,36.09 CLK_OUT+.1
  Route15 0.254: v38.02,17.98 35.48,20.52 35.48,35.12 31.12,35.12 CLK_OUT+.1
  Route15 0.279: v85.64,65.6 v85.64,35.75
GPIO_1_IN0_T9CLK  (via drill 0.35)
  Top 0.127: R7.1 57.54,20.36 54.05,20.36 54.05,20.2 SV2.1
  Top 0.254: U1.10 37.94,21.23 v38.65,20.52
  Route2 0.254: v38.65,20.52 50.45,20.52 51.04,21.11 53.03,21.11 SV2.1
GPIO_1_IN1_R9CLK  (via drill 0.35)
  Top 0.127: R7.2 57.54,22.1 54.05,22.1 54.05,22.58 SV2.3
  Top 0.254: U1.11 37.91,21.67 v38.65,22.42
  Route2 0.254: v38.65,22.42 50.39,22.42 51.04,21.77 53.03,21.77 SV2.3
GPIO_010_B6  (via drill 0.35)
  Top 0.152: U5.2 129.22,16.8 v128.45,16.8 | U5.4 v128.45,15.75
  Route2 0.127: v125.39,48.84 97.78,48.84 97.12,49.49 96.65,49.49 95.49,50.65 SV1.15
  Route15 0.127: v128.45,15.75 128.34,15.75 128.34,16.76 v128.45,16.8 128.45,29.4 125.39,32.45 v125.39,48.84
GPIO_10_F13  (via drill 0.35)
  Top 0.127: S2.4 61.03,10.51 61.03,14.16 60.08,15.12 R20.2 59.92,15.28 59.13,16.07 59.13,17.34 51.48,17.34 37.55,17.34 36.49,18.39 v36.49,18.41
  Top 0.152: U1.7 36.45,18.45 v36.49,18.41 | SV2.2 51.43,17.39 51.48,17.34
GPIO_011_A6  (via drill 0.35)
  Top 0.127: U5.6 129.07,14.83 127.87,14.83 127.87,13.75 v127.55,13.75
  Top 0.152: U5.8 127.87,13.75
  Route2 0.127: SV1.16 123.96,50.65 v123.99,50.61
  Route15 0.127: v123.99,50.61 123.99,17.31 v127.55,13.75
GPIO_11_T15  (via drill 0.35)
  Top 0.127: S2.3 63.57,10.51 63.57,14.64 63.1,15.12 R19.2 62.94,15.28 62.14,16.07 v62.14,17.66
  Top 0.152: U1.12 37.25,22.93 v37.25,23.13
  Route2 0.127: v48.3,23.23 37.36,23.23 v37.25,23.13 | v48.3,18.1 61.7,18.1 v62.14,17.66
  Route2 0.152: v48.3,23.23 50.91,23.23 SV2.4
  Route15 0.127: v48.3,23.23 v48.3,18.1
GPIO_12_T14  (via drill 0.35)
  Top 0.127: R13.2 69.92,15.12 v68.81,14.01 68.81,10.51 S2.1
  Top 0.152: U1.1 33.55,23.2 v33.32,23.44
  Route2 0.127: v33.32,23.44 36.72,23.44 37.06,23.78 54.27,23.78 57,23.78 57.76,24.54 58.15,24.54 58.99,23.69 v68.5,23.69
  Route2 0.152: SV2.5 54.27,24.95 54.27,23.78
  Route15 0.127: v68.5,23.69 68.5,14.32 v68.81,14.01
GPIO_13_T13
  Top 0.127: J38.2 20.87,28.93 20.87,34.64 T13N.1 20.71,34.8 20.71,36.55 19.28,37.98 19.28,39.88 16.9,39.88 R32.P$2
  Route2 0.127: J38.2 47.89,28.79 SV2.6
GPIO_14_R13
  Top 0.127: R13P.1 10.23,34.48 10.23,29.09 J17.2
  Route2 0.127: J17.2 16.53,29 17.55,30.03 49.17,30.03 50.15,29.04 52.72,29.04 SV2.7 | R161.P$2 7.81,38.38 8.07,38.38 10.1,36.35 R13P.1
GPIO_15_T12  (via drill 0.35)
  Top 0.127: S2.2 66.11,10.51 66.11,15.12 R18.2 66,15.53 65.26,16.27 65.26,18.54 v64.94,18.86
  Top 0.152: U1.6 32.64,18.97 v32.45,18.97
  Route2 0.127: v32.45,18.97 38.65,18.97 38.97,18.65 39.73,18.65 39.95,18.86 v52.62,18.86 v64.94,18.86
  Route15 0.152: SV2.8 52.62,26.6 v52.62,18.86
GPIO_018_E7  (via drill 0.35)
  Top 0.127: 127.87,33.7 127.87,33.75 127.87,34.8 129.14,34.8 U4.6
  Top 0.152: U4.8 127.87,33.75 | 127.87,33.7 v127.53,33.7
  Route2 0.127: SV1.23 96.03,40.49 97.27,41.73 v127.04,41.73 v127.04,41.72
  Route15 0.127: v127.04,41.72 127.04,33.98 127.32,33.7 v127.53,33.7
GPIO_022_F9  (via drill 0.35)
  Top 0.152: U4.13 v133.55,33.75 | U4.11 132.83,31.69 v133.52,31.69
  Route2 0.127: SV1.27 96.04,34.1 127.25,34.1 127.36,34.22 127.77,34.22 128.23,33.76 131.45,33.76 v133.52,31.69
  Route15 0.152: v133.52,31.69 133.52,33.72 v133.55,33.75
GPIO_23_C16  (via drill 0.35)
  Top 0.152: U4.2 129.22,36.8 v128.47,36.8 | U4.4 v128.45,35.75
  Route15 0.127: v128.45,35.75 128.34,35.75 128.34,36.75 v128.47,36.8
GPIO_026_E11  (via drill 0.35)
  Top 0.152: U3.2 129.17,56.85 v128.42,56.85 | U3.4 v128.45,55.75
  Route2 0.152: SV1.33 96.01,27.79 96.9,28.68 123.01,28.68 v123.11,28.77 | v123.11,55.82 123.16,55.77 128.43,55.77 v128.45,55.75
  Route15 0.127: v128.45,55.75 128.34,55.76 128.34,56.85 v128.42,56.85
  Route15 0.152: v123.11,28.77 v123.11,55.82
GPIO_028_C11  (via drill 0.35)
  Top 0.152: U3.13 v133.55,53.75 | U3.11 133.28,51.25 v133.52,51.25
  Route2 0.127: SV1.35 96.03,25.25 96.91,26.13 97.63,26.13 97.66,26.1 v135.55,26.1
  Route15 0.127: v135.55,26.1 135.55,49.22 v133.52,51.25
  Route15 0.152: v133.52,51.25 133.52,53.72 v133.55,53.75
GPIO_110_P11  (via drill 0.35)
  Top 0.127: 127.87,53.79 127.87,54.81 129.14,54.81 U3.6 | 127.87,53.79 127.83,53.75 v127.55,53.75 127.91,53.75 | 127.87,53.79 127.91,53.75 | 127.91,53.75 U3.8
  Route2 0.127: v64.43,64.33 v114.34,64.33 | SV2.15 64.39,37.95 v64.43,37.91
  Route2 0.152: v114.34,53.66 114.43,53.75 v127.55,53.75
  Route15 0.127: v64.43,37.91 v64.43,64.33
  Route15 0.152: v114.34,64.33 v114.34,53.66
GPIO_113_P9  (via drill 0.35)
  Top 0.127: U5.15 v134.45,14.75 134.05,15.15 134.05,15.45 133.75,15.75 U5.17
  Top 0.152: U5.17 132.78,15.8
  Route2 0.127: v135.78,7.2 135.63,7.05 v57.7,7.05
  Route15 0.127: v56.94,39.18 56.94,18.86 57.7,18.1 v57.7,7.05 | v135.78,7.2 135.78,13.42 v134.45,14.75
  Bottom 0.127: SV2.18 52.74,39.18 v56.94,39.18
GPIO_114_N9  (via drill 0.3, 0.35)
  Top 0.152: U3.19 v133.55,56.75 | v133.55,36.8 132.78,36.8 U4.19 | U5.19 132.83,16.85 v133.53,16.85 | v137.84,69.03 138.92,69.03 LED1.A | v129.84,57.98 130.25,57.57 U3.1 | U4.1 129.71,37.77 v129.71,37.79 | U5.1 129.63,17.85 v129.58,17.85
  Route2 0.127: v65.64,54.65 54.05,43.06 SV2.19 | v133.52,69.03 133.52,69.54 133.24,69.81 97.32,69.81 | v65.7,69.41 66.11,69.81 97.32,69.81 | R17.P$2 97.31,69.83 97.32,69.81
  Route2 0.152: v133.52,69.03 v137.84,69.03 | v133.55,56.75 131.07,56.75 v129.84,57.98 | v129.71,37.79 130.69,36.8 v133.55,36.8 | v129.58,17.85 130.58,16.85 v133.53,16.85
  Route15 0.127: v65.7,69.41 65.7,54.71 v65.64,54.65
  Route15 0.152: v133.53,16.85 133.53,30.41 132.76,31.18 132.76,36 v133.55,36.8 133.55,50.33 132.76,51.12 132.76,55.95 v133.55,56.75 133.55,69 v133.52,69.03
GPIO_115_N11  (via drill 0.35)
  Top 0.127: 132.88,12.77 U5.11
  Top 0.152: U5.13 v133.55,13.75 | v133.52,12.13 132.88,12.77
  Route2 0.127: v59.35,10.61 89.55,10.61 91.3,8.86 130.25,8.86 v133.52,12.13
  Route15 0.127: v59.35,41.85 v59.35,10.61
  Route15 0.152: v133.52,12.13 133.52,13.72 v133.55,13.75
  Bottom 0.127: SV2.20 52.61,41.85 v59.35,41.85
GPIO_116_L16  (via drill 0.35)
  Top 0.254: R16.2 20.08,61 v19.98,60.9 19.88,61 R15.1
  Route2 0.254: J32.2 23.71,48.79 26.59,45.92 50.45,45.92 51.04,46.51 51.82,46.51 52.76,45.57 SV2.21
  Route15 0.254: J32.2 20.22,54.42 L16_R11N.1 v19.98,60.9
GPIO_117_K16  (via drill 0.35)
  Route2 0.127: SV2.22 49.62,43.76 v22.9,43.76
  Route15 0.127: J23.2 20.81,15.18 20.71,15.28 | 20.71,15.28 K16N.1 21.88,16.71 21.88,37.56 22.9,38.58 v22.9,43.76 | R22.P$2 18.3,19.19 18.55,19.19 20.71,17.03 20.71,15.28
GPIO_118_R16  (via drill 0.35)
  Top 0.254: R4.2 v30.01,61 R3.1
  Route2 0.254: SV2.23 52.9,47.04 32.07,47.04 J34.2
  Route15 0.254: J34.2 30.09,49.02 R16_R15P.1 30.09,60.83 29.91,61 v30.01,61
GPIO_119_L15  (via drill 0.35)
  Top 0.254: R14.2 v9.95,60.67 R11.1
  Route2 0.254: SV2.24 42.09,48.11 41.59,47.62 33.18,47.62 30.69,50.11 11.38,50.11 J43.2
  Route15 0.254: J43.2 10.27,54.23 L15_R11P.1 9.9,60.63 v9.95,60.67
GPIO_120_P15  (via drill 0.35)
  Top 0.127: 134.06,34.72 134.06,34.75 134.06,35.75 132.79,35.75 U4.17
  Top 0.152: 134.06,34.72 132.75,34.72 U4.15 | 134.06,34.75 v134.45,34.75
  Route2 0.127: v134.92,22.29 134.88,22.26 98.06,22.26 97.63,21.83 59.58,21.83 v58.03,23.38
  Route15 0.127: v134.92,22.29 134.94,22.32 134.94,34.26 v134.45,34.75 | v58.03,23.38 58.03,46.59 SV2.25
GPIO_121_P16  (via drill 0.35)
  Top 0.254: R2.2 v39.92,61 R1.1
  Route2 0.254: J42.2 42.18,50.65 SV2.26
  Route15 0.254: J42.2 40.09,49.02 P16_R15N.1 40.09,60.83 v39.92,61
GPIO_126_L14  (via drill 0.35)
  Route2 0.127: SV2.33 52.31,62.47 50.11,62.47
  Route2 0.254: v35.73,63.19 49.2,63.19 49.92,62.47 50.11,62.47
  Route15 0.127: J7.2 v35.73,63.19
GPIO_128_M10  (via drill 0.35)
  Top 0.152: U2.2 78.55,14.53 v78.53,14.55
  Route2 0.127: SV2.35 52.67,63.35 51.79,64.23 23.01,64.23 v22.9,64.33
  Route2 0.152: v78.48,61.69 55.63,61.69 SV2.35
  Route15 0.127: v22.9,64.33 22.9,70.83 J12.2
  Route15 0.152: v78.53,14.55 78.48,14.6 v78.48,61.69
GPIO_129_L13  (via drill 0.3, 0.35)
  Route2 0.127: v49.6,63.54 51.19,63.54 51.35,63.38 SV2.36 | J7.1 34.53,69.66 v49.83,69.66
  Route15 0.127: v49.83,69.66 49.83,63.76 v49.6,63.54
GPIO_130_J16  (via drill 0.35)
  Top 0.152: v82.34,17.34 82.34,15.96 U2.15
  Route2 0.127: SV2.37 52.67,65.89 51.79,66.77 51.07,66.77 51.04,66.74 v20.23,66.74
  Route2 0.152: SV2.37 56.75,63.11 56.75,62.89 57.37,62.27 78.73,62.27 79.46,61.54 v79.54,61.54
  Route15 0.127: v20.23,66.74 20.19,66.79 J12.1
  Route15 0.152: v79.54,61.54 79.54,20.13 v82.34,17.34
GPIO_131_K15  (via drill 0.35)
  Route2 0.127: v11.22,65.6 51.14,65.6 SV2.38
  Route15 0.127: R23.P$2 7.73,19.19 8.03,19.19 10.06,17.17 | 10.06,17.17 10.06,16.83 K15P.1 10.29,15.18 J24.2 | 10.06,17.17 10.06,28 9.09,28.97 9.09,46.6 11.13,48.64 11.13,65.51 v11.22,65.6
GPIO_132_J13  (via drill 0.35)
  Top 0.127: 134.06,54.67 134.06,54.75 134.06,55.76 132.79,55.76 U3.17
  Top 0.152: U3.15 132.8,54.67 134.06,54.67 | 134.06,54.75 v135.21,54.75
  Route2 0.127: v135.17,73.6 v54.14,73.6
  Route15 0.127: v135.21,54.75 135.21,73.56 v135.17,73.6 | v54.14,73.6 54.14,68.6 SV2.39
N$2
  Top 0.127: R5.2 30.24,14.96 30.42,14.96 30.87,14.96 32.62,14.96 C1.1 | 30.71,8.45 CLK-IN+.1
  Top 0.349: CLK-IN+.1 30.67,12.27 30.97,12.56 30.97,14.41 30.42,14.96
N$3
  Top 0.127: C3.1 38.97,13.21 41.35,13.21 R6.2 41.51,13.21
  Top 0.349: CLK-IN-.1 41.36,13.13 R6.2
N$4
  Top 0.127: U1.3 33.41,21.15 31.66,21.15 31.66,17.34 33.41,15.59 33.41,13.85 32.78,13.21 C1.2
N$5  (via drill 0.35)
  Top 0.127: v34.97,15.05 35.09,14.94 C3.2
  Top 0.152: U1.4 33.41,20.64 33.06,20.64 32.81,20.39 v32.17,20.39
  Route15 0.127: v34.97,15.05 33.02,17 33.02,19.18 32.94,19.27 32.94,20.13 32.68,20.39 v32.17,20.39
N$6
  pour Top: 73.19,6.93 79.8,6.93 79.8,2.61 73.19,2.61
N$7
  Top 0.152: J1.3 80.81,5.68 81,5.86 81,6.14 R10.1 84.39,7.46 C12.1
N$9
  Top 0.127: LED1.C 141.2,69.09 145.01,69.09 R8.1
N$11
  Top 0.152: J1.2 80.16,6.37 R12.1 C10.2
N$12
  Top 0.152: R10.2 82.33,12.44 U2.6
N$13
  Top 0.152: R12.2 80.31,8.21 82.96,8.21 83.08,8.33 83.08,12.41 U2.7
N$14  (via drill 0.35)
  Top 0.152: C9.1 86.22,14.47 v86.15,14.55 | v80.05,15.18 U2.1
  Top 0.2: U2.9 C9.1
  Top 0.279: U2.8 U2.9
  Route2 0.152: v86.15,14.55 80.69,14.55 v80.05,15.18
OUT21  (via drill 0.35)
  Top 0.152: U5.18 v134.45,16.25 | U5.16 v133.55,15.25
  Route2 0.127: B6.1 151.66,16.75 139.96,16.75 139.46,16.25 v134.45,16.25
  Route15 0.127: v133.55,15.25 133.58,15.28 134.38,16.07 134.38,16.23 v134.45,16.25 | B6.1 152.96,12.2 OJ44.1
OUT22  (via drill 0.35)
  Top 0.152: U5.12 132.8,13.17 134.37,13.17 v134.45,13.25 134.45,13.63 133.78,14.3 132.78,14.3 U5.14
  Route2 0.127: v134.45,13.25 141.55,13.25 OJ43.1
  Route15 0.127: OJ43.1 142.75,17.79 A6.1
OUT23  (via drill 0.35)
  Top 0.127: v127.55,15.25 127.55,15.28 127.55,16.23 v127.55,16.25
  Top 0.152: U5.3 129.25,16.27 127.58,16.27 v127.55,16.25 | U5.5 129.25,15.23 127.58,15.23 v127.55,15.25
  Route2 0.127: P9.1 118.88,17.7 119.93,16.65 122.57,16.65 122.97,16.25 v127.55,16.25
  Route15 0.127: P9.1 118.88,12.27 OJ41.1
OUT24  (via drill 0.35)
  Top 0.152: U5.7 129.22,14.3 v128.45,14.3 | U5.9 129.22,13.2 v128.45,13.2
  Route2 0.127: v128.45,13.2 109.86,13.2 OJ42.1
  Route15 0.127: v128.45,13.2 128.34,13.32 128.34,14.22 v128.45,14.3 | N11.1 108.93,12.27 OJ42.1
OUT29  (via drill 0.35)
  Top 0.152: U4.18 v134.45,36.25 | U4.16 v133.55,35.25
  Route2 0.127: v134.45,36.25 139.46,36.25 139.96,36.75 151.66,36.75 C16.1
  Route15 0.127: v133.55,35.25 133.58,35.28 134.38,36.07 134.38,36.23 v134.45,36.25 | C16.1 152.96,32.2 OJ60.1
OUT30  (via drill 0.35)
  Top 0.127: 134.06,33.22 134.06,33.25 134.06,34.23 134.04,34.25 U4.14
  Top 0.152: 134.06,33.22 132.75,33.22 U4.12 | 134.06,33.25 v134.45,33.25
  Route2 0.127: v134.45,33.25 141.54,33.25 OJ59.1
  Route15 0.127: E7.1 143.02,32.3 OJ59.1
OUT31  (via drill 0.35)
  Top 0.127: v127.55,35.25 127.55,35.28 127.55,36.23 v127.55,36.25
  Top 0.152: v127.55,36.25 127.58,36.28 129.25,36.28 U4.3 | U4.5 129.2,35.17 127.63,35.17 v127.55,35.25
  Route2 0.127: v127.55,36.25 122.33,36.25 121.93,36.65 120.18,36.65 P15.1
  Route15 0.127: P15.1 118.88,32.27 OJ57.1
OUT32  (via drill 0.35)
  Top 0.152: U4.7 129.22,34.3 v128.45,34.3 | U4.9 129.2,33.17 v128.47,33.17
  Route2 0.127: v128.47,33.17 109.47,33.17 108.7,32.4 OJ58.1
  Route15 0.127: v128.47,33.17 128.34,33.33 128.34,34.22 v128.45,34.3 | F9.1 108.93,32.27 OJ58.1
OUT37  (via drill 0.35)
  Top 0.152: v134.45,56.25 134.4,56.2 132.78,56.2 U3.18 | U3.16 v133.55,55.25
  Route2 0.127: v134.45,56.25 139.46,56.25 139.96,56.75 151.66,56.75 E11.1
  Route15 0.127: v133.55,55.25 133.58,55.28 134.38,56.08 134.38,56.23 v134.45,56.25 | E11.1 152.96,52.2 OJ76.1
OUT38  (via drill 0.35)
  Top 0.127: 134.06,53.17 134.06,53.25 134.06,54.33 132.79,54.33 U3.14
  Top 0.152: U3.12 132.8,53.17 134.06,53.17 | 134.06,53.25 v134.45,53.25
  Route2 0.127: v134.45,53.25 141.54,53.25 OJ75.1
  Route15 0.127: P11.1 143.02,52.3 OJ75.1
OUT39  (via drill 0.35)
  Top 0.127: v127.55,55.25 127.55,55.28 127.55,56.33 v127.55,56.35 | OJ73.1 118.66,52.11 118.82,52.27 118.82,57.82 J13.1
  Top 0.152: v127.55,56.35 127.6,56.3 129.22,56.3 U3.3 | U3.5 129.25,55.22 127.58,55.22 v127.55,55.25
  Route2 0.127: v127.55,56.35 123.23,56.35 122.94,56.65 120.18,56.65 J13.1
OUT40  (via drill 0.35)
  Top 0.152: U3.7 v128.45,54.25 | U3.9 v128.45,53.25
  Route2 0.127: v128.45,53.25 114.79,53.25 114.64,53.09 109.75,53.09 OJ74.1
  Route15 0.127: v128.45,53.25 128.34,53.38 128.34,54.17 v128.45,54.25
  Route15 0.152: C11.1 108.93,52.27 OJ74.1

### Text on the board
tPlace: N9 (Outputs Enabled) | J16 | M10 | GND | 3V3 | L13 | L14 | GND | 5V | L15 | L16 | R16 | P16 | de0-nano board | PECL+ | PECL- | PV16 P | PV16 N | B8 | A8 | +ALT CLOCK- | DIFF I/O PAIR | OUT2 | OUT1 | FILTB | FILTA | DIFF I/O PAIR | +LASER CLOCK-
tNames: K | temporal demultiplexer adapter - de0 nano / Marc Gershow & Andy Haas
bNames: solder de0-nano this side / usb connector up / leds and dip switches / should be visible through / respective cutouts | 26 pin connector / (not connected) / here | temporal demultiplexer adapter; adapted by Marc Gershow from Andy Hass's trig3_board_de0_nano